# Altium project Line_FL_RB.PrjPcb
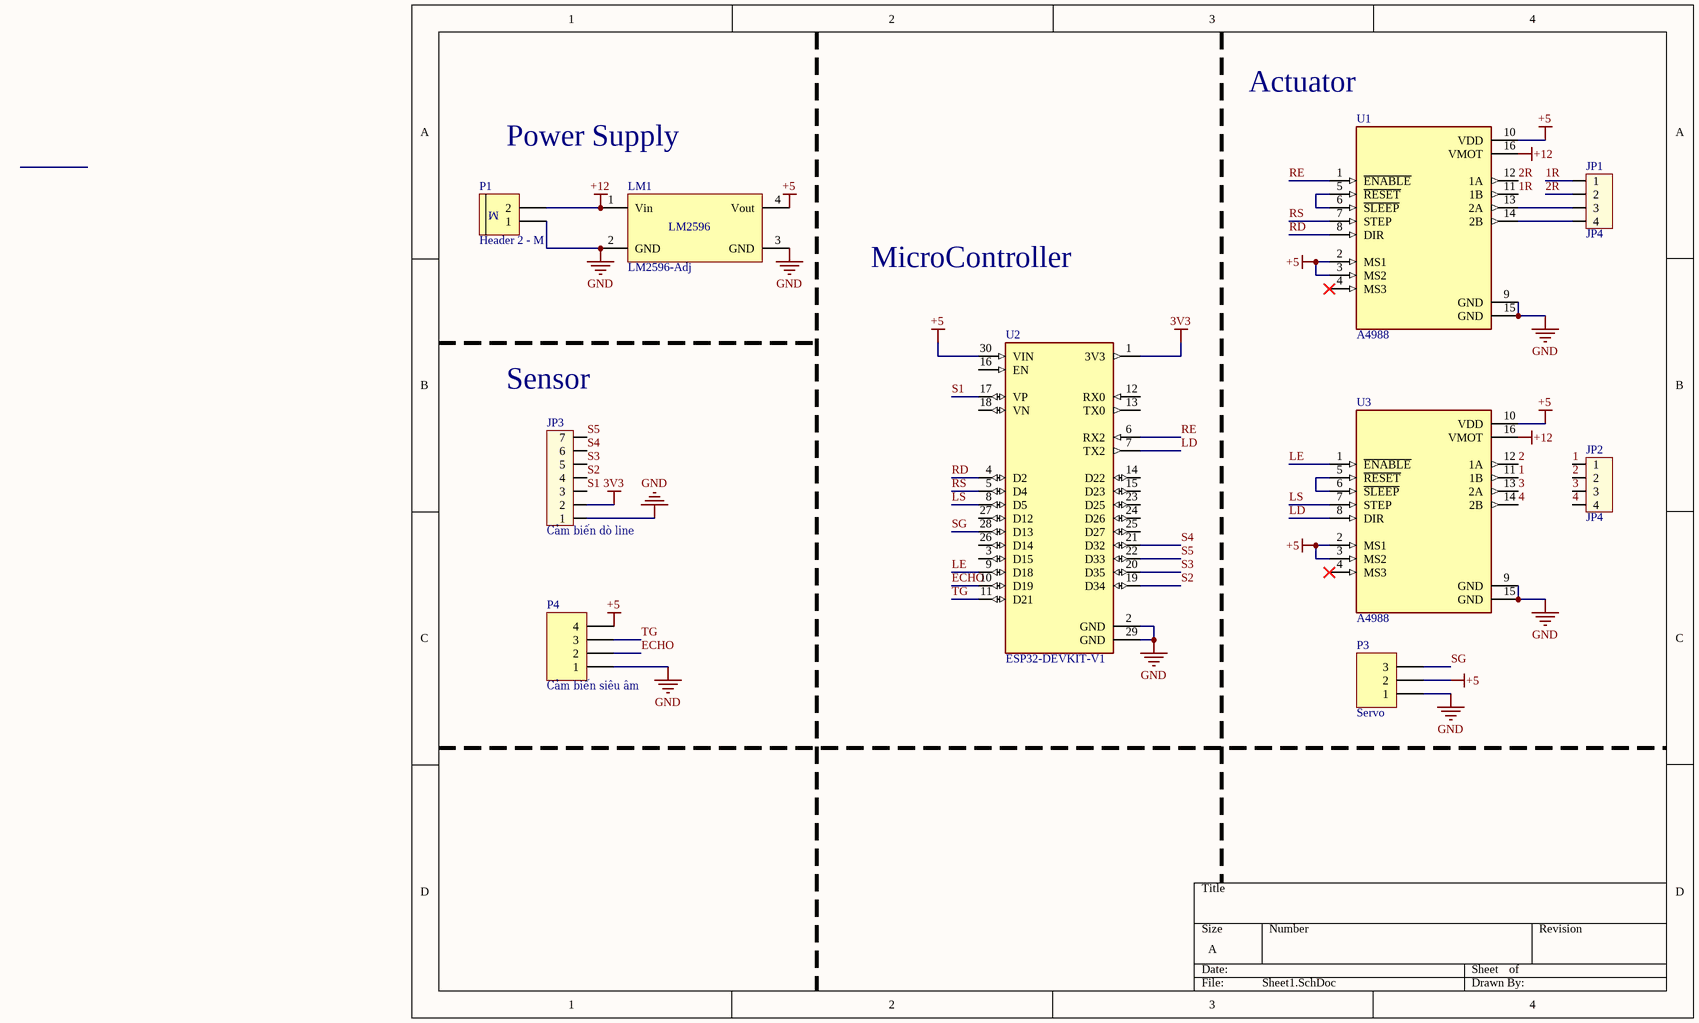
[diagram p0: Sheet1.SchDoc]
1 sheet, 10 parts. Net scope: global (net labels, ports and power ports of the same name join across sheets).
Board file: PCB1.PcbDoc

## Sheet Sheet1.SchDoc
size A; SheetNumber: 1; SheetTotal: 1

### Parts
JP1  JP4  [CON4]
JP2  JP4  [CON4]
JP3  Cảm biến dò line  [CON7]
LM1  LM2596-Adj  [lm2596]
P1  Header 2 - M  [Medium - Header 2]
P3  Servo  [Header 3]
P4  Cảm biến siêu âm  [Header 4]
U1  A4988  [MODULE_A4988_STEPPER_MOTOR_DRIVER_CARRIER]
U2  ESP32-DEVKIT-V1  [MODULE_ESP32_DEVKIT_V1]
U3  A4988  [MODULE_A4988_STEPPER_MOTOR_DRIVER_CARRIER]

### Nets
3V3: JP3.2 U2.1(3V3)
+5: LM1.4(Vout) P3.2 P4.4 U1.2(MS1) U1.3(MS2) U1.10(VDD) U2.30(VIN) U3.2(MS1) U3.3(MS2) U3.10(VDD)
+12: LM1.1(Vin) P1.2 U1.16(VMOT) U3.16(VMOT)
GND: JP3.1 LM1.2(GND) LM1.3(GND) P1.1 P3.1 P4.1 U1.9(GND) U1.15(GND) U2.2(GND) U2.29(GND) U3.9(GND) U3.15(GND)
1: JP2.1 U3.11(1B)
1R: JP1.1 U1.11(1B)
2: JP2.2 U3.12(1A)
2R: JP1.2 U1.12(1A)
3: JP2.3 U3.13(2A)
4: JP2.4 U3.14(2B)
ECHO: P4.2 U2.10(D19)
LD: U2.7(TX2) U3.8(DIR)
LE: U2.9(D18) U3.1(~{ENABLE})
LS: U2.8(D5) U3.7(STEP)
RD: U1.8(DIR) U2.4(D2)
RE: U1.1(~{ENABLE}) U2.6(RX2)
RS: U1.7(STEP) U2.5(D4)
S1: JP3.3 U2.17(VP)
S2: JP3.4 U2.19(D34)
S3: JP3.5 U2.20(D35)
S4: JP3.6 U2.21(D32)
S5: JP3.7 U2.22(D33)
SG: P3.3 U2.28(D13)
TG: P4.3 U2.11(D21)
NetJP1_3: JP1.3 U1.13(2A)
NetJP1_4: JP1.4 U1.14(2B)
NetU1_5: U1.5(~{RESET}) U1.6(~{SLEEP})
NetU3_5: U3.5(~{RESET}) U3.6(~{SLEEP})

Not connected (* = marked no-connect by the designer): U1 4(MS3)*; U2 3(D15) 12(RX0) 13(TX0) 14(D22) 15(D23) 16(EN) 18(VN) 23(D25) 24(D26) 25(D27) 26(D14) 27(D12); U3 4(MS3)*

### Notes on the sheet
- (near U1) Actuator
- Power Supply
- MicroController
- (near JP3) Sensor
- (in symbol Header 2 - M) M
- (in symbol LM2596-Adj) LM2596

### Library data of the parts
JP1 JP2 = Con4: Connector 4; Value: Connector 4
JP3 = Con7: Connector 7; Value: Connector 7
LM1 = LM2596-Adj: Designed By @Alixahedi
P1 = Header 2 - M: Header, 2-Pin, Medium; LatestRevisionDate: 17-Jul-2002; LatestRevisionNote: Re-released for DXP Platform.; Publisher: Altium Limited
P3 = Header 3: Header, 3-Pin; LatestRevisionDate: 17-Jul-2002; LatestRevisionNote: Re-released for DXP Platform.; Publisher: Altium Limited
P4 = Header 4: Header, 4-Pin; LatestRevisionDate: 17-Jul-2002; LatestRevisionNote: Re-released for DXP Platform.; Publisher: Altium Limited
U1 U3 = A4988_STEPPER_MOTOR_DRIVER_CARRIER: Stepper motor controler; IC: A4988; 1A; Uin mot: 8Ã·35V; Price: None; Value: *; MP: A4988_STEPPER_MOTOR_DRIVER_CARRIER; Package: None; Availability: Unavailable
U2 = ESP32-DEVKIT-V1: Dual core, Wi-Fi: 2.4 GHz up to 150 Mbits/s,BLE (Bluetooth Low Energy) and legacy Bluetooth, 32 bits, Up to 240 MHz; MF: Do it; Price: None; Availability: Not in stock; Package: None; MP: ESP32-DEVKIT-V1; Value: *; SnapEDA_Link: https://www.snapeda.com/parts/ESP32-DEVKIT-V1/Do+it/view-part/?ref=snap; Check_prices: https://www.snapeda.com/parts/ESP32-DEVKIT-V1/Do+it/view-part/?ref=eda